# EAGLE design quadcopter (EAGLE 9.0.1)
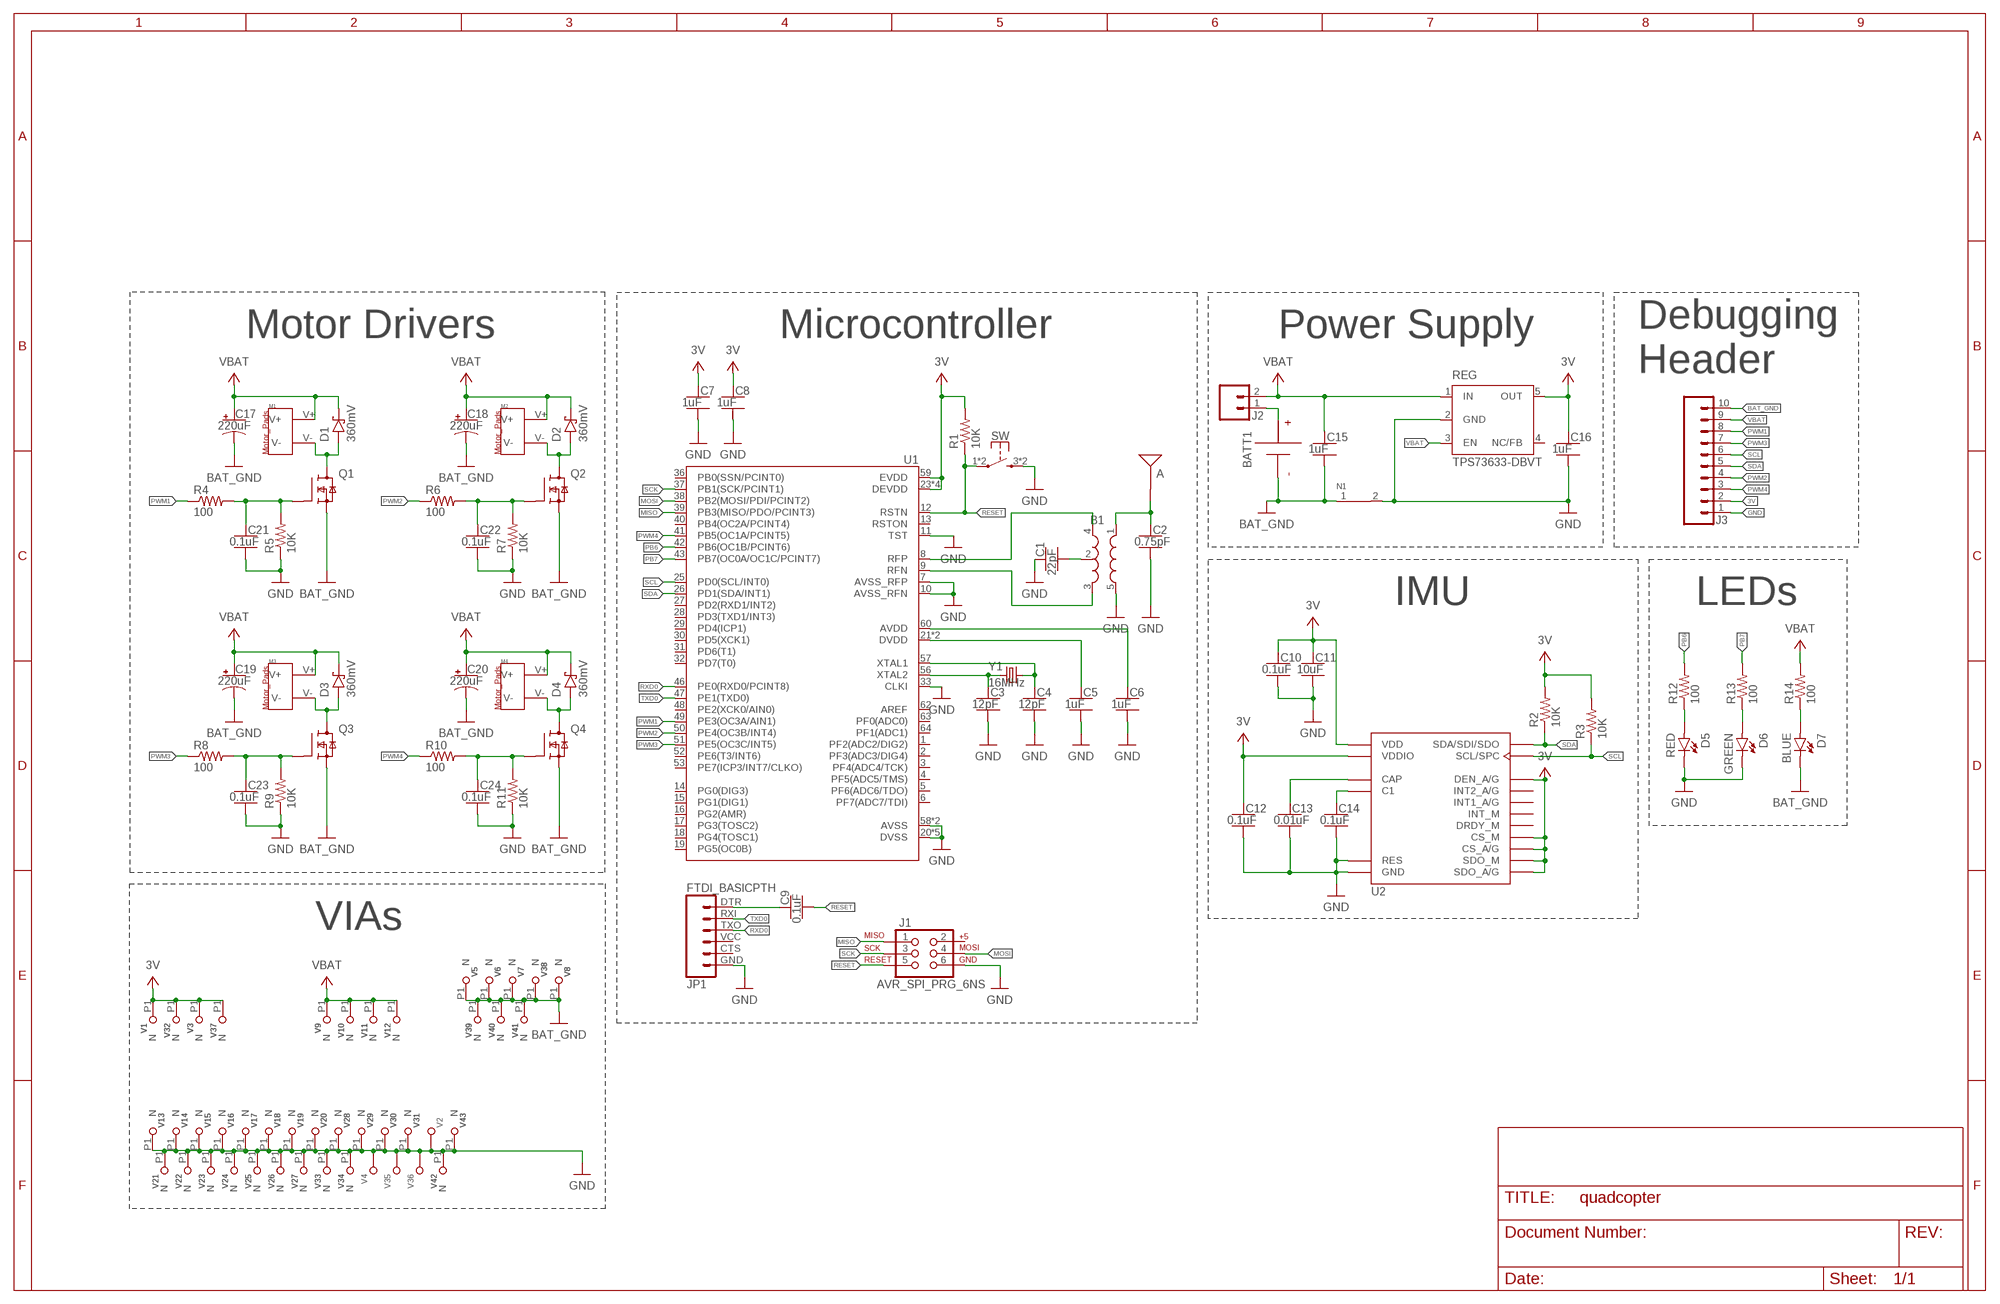
[diagram p0: schematic, sheet 1]
FRAME1 (FRAME_B_L): CREATOR: Unknown; DIST: Unknown; DISTPN: Unknown

## Parts
A  ANTENNA2SMD5  [ANTENNA-CHIP5]
B1  BALUN0805  [BALUN]
BATT1  BATTERY  [BATTERY-TERMINALS]
C1  22pF  CAPACITOR-NP_SMD-2012-0805_CERAMIC-22PF  [CAPC2012X140_HS]
C2  0.75pF  CAPACITOR-NP_SMD-2012-0805_CERAMIC-0.75PF  [CAPC2012X140_HS]
C3  12pF  CAPACITOR-NP_SMD-2012-0805_CERAMIC-12PF  [CAPC2012X140_HS]
C4  12pF  CAPACITOR-NP_SMD-2012-0805_CERAMIC-12PF  [CAPC2012X140_HS]
C5  1uF  CAPACITOR-NP_SMD-2012-0805_CERAMIC-1UF  [CAPC2012X140_HS]
C6  1uF  CAPACITOR-NP_SMD-2012-0805_CERAMIC-1UF  [CAPC2012X140_HS]
C7  1uF  CAPACITOR-NP_SMD-2012-0805_CERAMIC-1UF  [CAPC2012X140_HS]
C8  1uF  CAPACITOR-NP_SMD-2012-0805_CERAMIC-1UF  [CAPC2012X140_HS]
C9  0.1uF  CAPACITOR-NP_SMD-2012-0805_CERAMIC-0.1UF  [CAPC2012X140_HS]
C10  0.1uF  CAPACITOR-NP_SMD-2012-0805_CERAMIC-0.1UF  [CAPC2012X140_HS]
C11  10uF  CAPACITOR-NP_SMD-2012-0805_CERAMIC-10UF  [CAPC2012X140_HS]
C12  0.1uF  CAPACITOR-NP_SMD-2012-0805_CERAMIC-0.1UF  [CAPC2012X140_HS]
C13  0.01uF  CAPACITOR-NP_SMD-2012-0805_CERAMIC-0.01UF  [CAPC2012X140_HS]
C14  0.1uF  CAPACITOR-NP_SMD-2012-0805_CERAMIC-0.1UF  [CAPC2012X140_HS]
C15  1uF  CAPACITOR-NP_SMD-2012-0805_CERAMIC-1UF  [CAPC2012X140_HS]
C16  1uF  CAPACITOR-NP_SMD-2012-0805_CERAMIC-1UF  [CAPC2012X140_HS]
C17  220uF  CAPACITOR-POL_SMD-7043-D_TANTALUM-220UF  [CAPMP7343X310_HS]
C18  220uF  CAPACITOR-POL_SMD-7043-D_TANTALUM-220UF  [CAPMP7343X310_HS]
C19  220uF  CAPACITOR-POL_SMD-7043-D_TANTALUM-220UF  [CAPMP7343X310_HS]
C20  220uF  CAPACITOR-POL_SMD-7043-D_TANTALUM-220UF  [CAPMP7343X310_HS]
C21  0.1uF  CAPACITOR-NP_SMD-2012-0805_CERAMIC-0.1UF  [CAPC2012X140_HS]
C22  0.1uF  CAPACITOR-NP_SMD-2012-0805_CERAMIC-0.1UF  [CAPC2012X140_HS]
C23  0.1uF  CAPACITOR-NP_SMD-2012-0805_CERAMIC-0.1UF  [CAPC2012X140_HS]
C24  0.1uF  CAPACITOR-NP_SMD-2012-0805_CERAMIC-0.1UF  [CAPC2012X140_HS]
D1  360mV  DIODE-SCHOTTKY_SMD-SOD123-360MV  [SOD3716X135_HS]
D2  360mV  DIODE-SCHOTTKY_SMD-SOD123-360MV  [SOD3716X135_HS]
D3  360mV  DIODE-SCHOTTKY_SMD-SOD123-360MV  [SOD3716X135_HS]
D4  360mV  DIODE-SCHOTTKY_SMD-SOD123-360MV  [SOD3716X135_HS]
D5  RED  LED_RED  [LED_0805]
D6  GREEN  LED_GREEN  [LED_0805]
D7  BLUE  LED_BLUE  [LED_0805]
J1  AVR_SPI_PRG_6NS  [2X3-NS]
J2  MALE_HEADER_2POS-2X1-0.1IN  [MALE_HEADER_2X1_0.1IN]
J3  SIP-10_TH-254X10  [HDRV10W63P254_10X1_2540X254H838_HS]
JP1  FTDI_BASICPTH  [FTDI_BASIC]
M1  MOTOR_PADS  [MOTOR_PADS]
M2  MOTOR_PADS  [MOTOR_PADS]
M3  MOTOR_PADS  [MOTOR_PADS]
M4  MOTOR_PADS  [MOTOR_PADS]
N1  NET_BRIDGE  [NET_BRIDGE]
Q1  MOSFET_SOT-23  [SI2302CDS_T1_E3]
Q2  MOSFET_SOT-23  [SI2302CDS_T1_E3]
Q3  MOSFET_SOT-23  [SI2302CDS_T1_E3]
Q4  MOSFET_SOT-23  [SI2302CDS_T1_E3]
R1  10K  RESISTOR_SMD-2012-0805-10K  [RESC2012X60_HS]
R2  10K  RESISTOR_SMD-2012-0805-10K  [RESC2012X60_HS]
R3  10K  RESISTOR_SMD-2012-0805-10K  [RESC2012X60_HS]
R4  100  RESISTOR_SMD-2012-0805-100  [RESC2012X60_HS]
R5  10K  RESISTOR_SMD-2012-0805-10K  [RESC2012X60_HS]
R6  100  RESISTOR_SMD-2012-0805-100  [RESC2012X60_HS]
R7  10K  RESISTOR_SMD-2012-0805-10K  [RESC2012X60_HS]
R8  100  RESISTOR_SMD-2012-0805-100  [RESC2012X60_HS]
R9  10K  RESISTOR_SMD-2012-0805-10K  [RESC2012X60_HS]
R10  100  RESISTOR_SMD-2012-0805-100  [RESC2012X60_HS]
R11  10K  RESISTOR_SMD-2012-0805-10K  [RESC2012X60_HS]
R12  100  RESISTOR_SMD-2012-0805-100  [RESC2012X60_HS]
R13  100  RESISTOR_SMD-2012-0805-100  [RESC2012X60_HS]
R14  100  RESISTOR_SMD-2012-0805-100  [RESC2012X60_HS]
REG  TPS73633-DBVT  [SOT23-DBV]
SW  PUSHBUTTON_SMD-VERTICAL-1  [TE_FSM8JSMA_HS]
U1  ATMEGA128RFA1  [QFN-64]
U2  IMU_LSM9DS1TR  [LSM9DS1TR]
V1  LOCKED-VIA-0.254  [VIA-0.254MM]
V2  VIA_0.454  [VIA_0.454]
V3  LOCKED-VIA-0.254  [VIA-0.254MM]
V4  VIA_0.454  [VIA_0.454]
V5  LOCKED-VIA-0.254  [VIA-0.254MM]
V6  LOCKED-VIA-0.254  [VIA-0.254MM]
V7  LOCKED-VIA-0.254  [VIA-0.254MM]
V8  LOCKED-VIA-0.254  [VIA-0.254MM]
V9  LOCKED-VIA-0.254  [VIA-0.254MM]
V10  LOCKED-VIA-0.254  [VIA-0.254MM]
V11  LOCKED-VIA-0.254  [VIA-0.254MM]
V12  LOCKED-VIA-0.254  [VIA-0.254MM]
V13  LOCKED-VIA-0.254  [VIA-0.254MM]
V14  LOCKED-VIA-0.254  [VIA-0.254MM]
V15  LOCKED-VIA-0.254  [VIA-0.254MM]
V16  LOCKED-VIA-0.254  [VIA-0.254MM]
V17  LOCKED-VIA-0.254  [VIA-0.254MM]
V18  LOCKED-VIA-0.254  [VIA-0.254MM]
V19  LOCKED-VIA-0.254  [VIA-0.254MM]
V20  LOCKED-VIA-0.254  [VIA-0.254MM]
V21  LOCKED-VIA-0.254  [VIA-0.254MM]
V22  LOCKED-VIA-0.254  [VIA-0.254MM]
V23  LOCKED-VIA-0.254  [VIA-0.254MM]
V24  LOCKED-VIA-0.254  [VIA-0.254MM]
V25  LOCKED-VIA-0.254  [VIA-0.254MM]
V26  LOCKED-VIA-0.254  [VIA-0.254MM]
V27  LOCKED-VIA-0.254  [VIA-0.254MM]
V28  LOCKED-VIA-0.254  [VIA-0.254MM]
V29  LOCKED-VIA-0.254  [VIA-0.254MM]
V30  LOCKED-VIA-0.254  [VIA-0.254MM]
V31  LOCKED-VIA-0.254  [VIA-0.254MM]
V32  LOCKED-VIA-0.254  [VIA-0.254MM]
V33  LOCKED-VIA-0.254  [VIA-0.254MM]
V34  LOCKED-VIA-0.254  [VIA-0.254MM]
V35  VIA_0.454  [VIA_0.454]
V36  VIA_0.454  [VIA_0.454]
V37  LOCKED-VIA-0.254  [VIA-0.254MM]
V38  LOCKED-VIA-0.254  [VIA-0.254MM]
V39  LOCKED-VIA-0.254  [VIA-0.254MM]
V40  LOCKED-VIA-0.254  [VIA-0.254MM]
V41  LOCKED-VIA-0.254  [VIA-0.254MM]
V42  LOCKED-VIA-0.254  [VIA-0.254MM]
V43  LOCKED-VIA-0.254  [VIA-0.254MM]
Y1  16MHz  CRYSTAL5X3  [CRYSTAL-SMD-5X3]

## Nets
3V: C7.1 C8.1 C10.1 C11.1 C12.1 C16.1 J3.2 R1.2 R2.2 R3.2 REG.5(OUT) U1.23(DEVDD) U1.34(DEVDD) U1.44(DEVDD) U1.54(DEVDD) U1.59(EVDD) U2.CS_A/G U2.CS_M U2.DEN_A/G U2.SDO_A/G U2.SDO_M U2.VDD U2.VDD_23(VDD) U2.VDDIO U2.VDDIO_3(VDDIO) V1.P1(N) V3.P1(N) V32.P1(N) V37.P1(N)
BAT_GND [HIGHCURRENT]: BATT1.-(N) C15.2 C17.2(-) C18.2(-) C19.2(-) C20.2(-) D7.C J3.10 N1.1 Q1.S Q2.S Q3.S Q4.S V5.P1(N) V6.P1(N) V7.P1(N) V8.P1(N) V38.P1(N) V39.P1(N) V40.P1(N) V41.P1(N)
BATT1: BATT1.+(P) J2.1
C1: B1.2(GND) C1.2
C2 [RFSIG]: A.FEED(SIGNAL) B1.1(IN) C2.1
C3: C3.1 U1.56(XTAL2) Y1.1
C4: C4.1 U1.57(XTAL1) Y1.3
C5: C5.1 U1.21(DVDD) U1.22(DVDD)
C6: C6.1 U1.60(AVDD)
C9: C9.1 JP1.DTR
C13: C13.1 U2.CAP
C14: C14.1 U2.C1
C21: C21.1 Q1.G R4.2 R5.2
C22: C22.1 Q2.G R6.2 R7.2
C23: C23.1 Q3.G R8.2 R9.2
C24: C24.1 Q4.G R10.2 R11.2
D5: D5.A R12.1
D6: D6.A R13.1
D7: D7.A R14.1
GND: B1.5(GND) C1.1 C2.2 C3.2 C4.2 C5.2 C6.2 C7.2 C8.2 C10.2 C11.2 C12.2 C13.2 C14.2 C16.2 C21.2 C22.2 C23.2 C24.2 D5.C D6.C J1.6 J3.1 JP1.GND N1.2 R5.1 R7.1 R9.1 R11.1 REG.2(GND) SW.3 SW.4 U1.7(AVSS_RFP) U1.10(AVSS_RFN) U1.11(TST) U1.20(DVSS) U1.24(DVSS) U1.33(CLKI) U1.35(DVSS) U1.45(DVSS) U1.55(DVSS) U1.58(AVSS) U1.61(AVSS) U2.GND U2.GND_20(GND) U2.RES U2.RES_15(RES) U2.RES_16(RES) U2.RES_17(RES) U2.RES_18(RES) V2.VIA V4.VIA V13.P1(N) V14.P1(N) V15.P1(N) V16.P1(N) V17.P1(N) V18.P1(N) V19.P1(N) V20.P1(N) V21.P1(N) V22.P1(N) V23.P1(N) V24.P1(N) V25.P1(N) V26.P1(N) V27.P1(N) V28.P1(N) V29.P1(N) V30.P1(N) V31.P1(N) V33.P1(N) V34.P1(N) V35.VIA V36.VIA V42.P1(N) V43.P1(N)
M1 [HIGHCURRENT]: D1.A M1.V- Q1.D
M2 [HIGHCURRENT]: D2.A M2.V- Q2.D
M3 [HIGHCURRENT]: D3.A M3.V- Q3.D
M4 [HIGHCURRENT]: D4.A M4.V- Q4.D
MISO: J1.1 U1.39(PB3(MISO/PDO/PCINT3))
MOSI: J1.4 U1.38(PB2(MOSI/PDI/PCINT2))
PB6: R12.2 U1.42(PB6(OC1B/PCINT6))
PB7: R13.2 U1.43(PB7(OC0A/OC1C/PCINT7))
PWM1: J3.8 R4.1 U1.49(PE3(OC3A/AIN1))
PWM2: J3.4 R6.1 U1.50(PE4(OC3B/INT4))
PWM3: J3.7 R8.1 U1.51(PE5(OC3C/INT5))
PWM4: J3.3 R10.1 U1.41(PB5(OC1A/PCINT5))
RESET: C9.2 J1.5 R1.1 SW.1 SW.2 U1.12(RSTN)
RFN: B1.3(OUT2) U1.9(RFN)
RFP: B1.4(OUT1) U1.8(RFP)
RXD0: JP1.TXO U1.46(PE0(RXD0/PCINT8))
SCK: J1.3 U1.37(PB1(SCK/PCINT1))
SCL: J3.6 R3.1 U1.25(PD0(SCL/INT0)) U2.SCL/SPC
SDA: J3.5 R2.1 U1.26(PD1(SDA/INT1)) U2.SDA/SDI/SDO
TXD0: JP1.RXI U1.47(PE1(TXD0))
VBAT [HIGHCURRENT]: C15.1 C17.1(+) C18.1(+) C19.1(+) C20.1(+) D1.C D2.C D3.C D4.C J2.2 J3.9 M1.V+ M2.V+ M3.V+ M4.V+ R14.2 REG.1(IN) REG.3(EN) V9.P1(N) V10.P1(N) V11.P1(N) V12.P1(N)
Unconnected: J1.2 JP1.CTS JP1.VCC REG.4(NC/FB) U1.1(PF2(ADC2/DIG2)) U1.2(PF3(ADC3/DIG4)) U1.3(PF4(ADC4/TCK)) U1.4(PF5(ADC5/TMS)) U1.5(PF6(ADC6/TDO)) U1.6(PF7(ADC7/TDI)) U1.13(RSTON) U1.14(PG0(DIG3)) U1.15(PG1(DIG1)) U1.16(PG2(AMR)) U1.17(PG3(TOSC2)) U1.18(PG4(TOSC1)) U1.19(PG5(OC0B)) U1.27(PD2(RXD1/INT2)) U1.28(PD3(TXD1/INT3)) U1.29(PD4(ICP1)) U1.30(PD5(XCK1)) U1.31(PD6(T1)) U1.32(PD7(T0)) U1.36(PB0(SSN/PCINT0)) U1.40(PB4(OC2A/PCINT4)) U1.48(PE2(XCK0/AIN0)) U1.52(PE6(T3/INT6)) U1.53(PE7(ICP3/INT7/CLKO)) U1.62(AREF) U1.63(PF0(ADC0)) U1.64(PF1(ADC1)) U2.DRDY_M U2.INT1_A/G U2.INT2_A/G U2.INT_M

## Notes on the sheet
- Motor Drivers | Microcontroller | Power Supply
- Debugging
  Header
- IMU | LEDs
- VIAs

## Library data of the parts
A = quadparts_prebuilt:ANTENNA2: Chip antenna Single endded antenna. Common with smaller chip antennas. CHIP4 package is the GPS Chip Antenna SKU: GPS-08418. CHIP5 package is 2.4GHz chip antenna SKU: WRL-00144.; CREATOR: Swanson; DATASHEET: http://www.linxtechnologies.com/resources/data-guides/ant-xxx-chp-x.pdf; DIST: Digikey; DISTPN: ANT-2.45-CHPCT-ND; MFR: Linx Technologies Inc.; MPN: ANT-2.45-CHP-T; PRICE: 3.16; REVIEWER: Swanson
B1 = quadparts_prebuilt:BALUN: 0805 footprint balun- Ember 351/357; CREATOR: Swanson; DATASHEET: http://katalog.we-online.de/pbs/datasheet/748421245.pdf; DIST: Digikey; DISTPN: 732-2230-6-ND; MFR: Wurth Electronics Inc; MPN: 748421245; PRICE: 2.63; REVIEWER: Swanson
BATT1 = quadparts_prebuilt:BATTERY; CREATOR: Swanson; DIST: NA; DISTPN: NA
C1 = quadparts_prebuilt:CAPACITOR-NP_: Nonpolarized capacitor; CREATOR: Swanson; DIST: Digikey; DISTPN: 490-5534-1-ND; MFR: Murata Electronics North America; MPN: GRM21A5C2E220JW01D; REVIEWER: Swanson
C2 = quadparts_prebuilt:CAPACITOR-NP_: Nonpolarized capacitor; CREATOR: Swanson; DIST: Digikey; DISTPN: 490-3585-1-ND; MFR: Murata Electronics North America; MPN: GQM2195C2AR75CB01D; REVIEWER: Swanson
C3 C4 = quadparts_prebuilt:CAPACITOR-NP_: Nonpolarized capacitor; CREATOR: Swanson; DIST: Digikey; DISTPN: 490-5531-1-ND; MFR: Murata Electronics North America; MPN: GRM21A5C2E120JW01D; REVIEWER: Swanson
C5-C8 C15 C16 = quadparts_prebuilt:CAPACITOR-NP_: Nonpolarized capacitor; CREATOR: Swanson; DIST: Digikey; DISTPN: 587-1281-1-ND; MFR: Taiyo Yuden; MPN: TMK212B7105KG-T; REVIEWER: Swanson
C9 C10 C12 C14 C21-C24 = quadparts_prebuilt:CAPACITOR-NP_: Nonpolarized capacitor; CREATOR: Swanson; DIST: Digikey; DISTPN: 445-1418-1-ND; MFR: TDK; MPN: C2012X7R2A104K125AA; REVIEWER: Swanson
C11 = quadparts_prebuilt:CAPACITOR-NP_: Nonpolarized capacitor; CREATOR: Swanson; DIST: Digikey; DISTPN: 445-14388-1-ND; MFR: TDK Corporation; MPN: C2012X5R1E106M085AC; REVIEWER: Swanson
C13 = quadparts_prebuilt:CAPACITOR-NP_: Nonpolarized capacitor; CREATOR: Swanson; DIST: Digikey; DISTPN: 1608-1458-1-ND; MFR: Knowles Syfer; MPN: 0805J0500104KJT; REVIEWER: Swanson
C17-C20 = quadparts_prebuilt:CAPACITOR-POL_: Polarized capacitor; CREATOR: Swanson; DIST: Digikey; DISTPN: 478-8912-1-ND; MFR: AVX Corporation; MPN: TAJD227K006RNJ; REVIEWER: Swanson
D1-D4 = quadparts_prebuilt:DIODE-SCHOTTKY_: Schottky diode; CREATOR: Swanson; DIST: Digikey; DISTPN: CRS08QMCT-ND; MFR: Toshiba Semiconductor and Storage; MPN: CRS08(TE85L,Q,M); REVIEWER: Swanson
D5 = custom:LED_: Light emitting diode; CREATOR: Jeongjoon; DIST: Digikey; DISTPN: 160-1415-1-ND; MFR: Lite-On Inc; MPN: LTST-C170KRKT
D6 = custom:LED_: Light emitting diode; CREATOR: Jeongjoon; DIST: Digikey; DISTPN: 160-1887-1-ND; MFR: Lite-On Inc; MPN: LTST-C170TGKT
D7 = custom:LED_: Light emitting diode; CREATOR: Jeongjoon; DIST: Digikey; DISTPN: 160-1579-1-ND; MFR: Lite-On Inc; MPN: LTST-C170TBKT
J1 = quadparts_prebuilt:AVR_SPI_PRG_6: AVR ISP 6 Pin This is the reduced ISP connector for AVR programming. Common on Arduino. This footprint will take up less PCB space and can be used with a 10-pin to 6-pin adapter such as SKU: BOB-08508; CREATOR: Swanson; DATASHEET: http://portal.fciconnect.com/Comergent//fci/drawing/67996.pdf; DIST: Digikey; DISTPN: 609-3234-ND; MFR: Amphenol FCI; MPN: 67997-206HLF; PRICE: 0.31; REVIEWER: Swanson
J2 = custom:MALE_HEADER_2POS: 2 pin single inline pin header, socket, or connector; CREATOR: SWANSON; DIST: Digikey; DISTPN: 3M9447-ND; MFR: 3M; MPN: 961102-6404-AR; REVIEWER: Swanson
J3 = quadparts_prebuilt:SIP-10_: 10 pin single inline pin header, socket, or connector; CREATOR: Swanson; DATASHEET: http://portal.fciconnect.com/Comergent//fci/drawing/68000.pdf; DIST: Digikey; DISTPN: 609-3250-ND; MFR: Amphenol FCI; MPN: 68000-110HLF; PRICE: 0.55; REVIEWER: Swanson
JP1 = quadparts_prebuilt:FTDI_BASIC: FTDI Basic header with labels; CREATOR: Swanson; DATASHEET: http://portal.fciconnect.com/Comergent//fci/drawing/68015.pdf; DIST: Digikey; DISTPN: 609-3327-ND; MFR: Amphenol FCI; MPN: 68016-406HLF; PRICE: 0.33; REVIEWER: Swanson
M1-M4 = quadparts_prebuilt:MOTOR_PADS; CREATOR: Swanson; DIST: NA; DISTPN: NA; MFR: NA; MPN: NA; REVIEWER: Swanson
N1 = custom:NET_: Net Bridge; CREATOR: Jeongjoon; DIST: NA; DISTPN: NA
Q1-Q4 = custom:MOSFET_: N-Channel MOSFET; CREATOR: Jeongjoon; DIST: Digikey; DISTPN: SI2302CDS-T1-E3CT-ND; MFR: Vishay Siliconix; MPN: SI2302CDS-T1-E3
R1-R3 R5 R7 R9 R11 = quadparts_prebuilt:RESISTOR_: Resistor; CREATOR: Swanson; DIST: Digikey; DISTPN: 311-10KARCT-ND; MFR: Yageo; MPN: RC0805JR-0710KL; REVIEWER: Swanson
R4 R6 R8 R10 R12-R14 = quadparts_prebuilt:RESISTOR_: Resistor; CREATOR: Swanson; DIST: Digikey; DISTPN: 311-100ARCT-ND; MFR: Yageo; MPN: RC0805JR-07100RL; REVIEWER: Swanson
REG = quadparts_prebuilt:TPS73633-DBVT; CREATOR: Swanson; DATASHEET: http://www.ti.com/lit/ds/symlink/lp3985.pdf; DIST: Digikey; DISTPN: LP3985IM5X-3.0/NOPBCT-ND; MFR: Texas Instruments; MPN: LP3985IM5X-3.0/NOPB; PRICE: 0.59; REVIEWER: Swanson
SW = quadparts_prebuilt:PUSHBUTTON_: Pushbutton with 2 pins shorting 1 to 2 and two extra mounting pins 3 & 4; CREATOR: Swanson; DIST: Digikey; DISTPN: 450-1129-ND; MFR: TE Connectivity Alcoswitch Switches; MPN: FSM4JSMA; REVIEWER: Swanson
U1 = quadparts_prebuilt:ATMEGA128RFA1: ATmega128RFA1 8-bit AVR Microcontroller with Low Power 2.4GHz Transceiver for ZigBee and IEEE 802.15.4; CREATOR: Swanson; DATASHEET: http://www.atmel.com/Images/Atmel-8266-MCU_Wireless-ATmega128RFA1_Datasheet.pdf; DIST: Digikey; DISTPN: ATMEGA128RFA1-ZU-ND; MFR: Atmel; MPN: ATMEGA128RFA1-ZUR00; PRICE: 10.21; REVIEWER: Swanson
U2 = custom:IMU_: LSM9DS1TR 9-Axis IMU; CREATOR: Jeongjoon; DIST: Digikey; DISTPN: 497-14946-1-ND; MFR: STMicroelectronics; MPN: LSM9DS1TR
V1 V3 V5-V34 V37-V43 = quadparts_prebuilt:LOCKED-VIA; CREATOR: Swanson; DIST: NA; DISTPN: NA
V2 V4 V35 V36 = custom:VIA_: Via; CREATOR: Jeongjoon; DIST: N/A; DISTPN: N/A; MFR: N/A; MPN: N/A
Y1 = quadparts_prebuilt:CRYSTAL: Various standard crystals. Proven footprints.; CREATOR: Swanson; DATASHEET: http://www.abracon.com/Resonators/abm3b.pdf; DIST: Digikey; DISTPN: 535-9122-1-ND; MFR: Abracon LLC; MPN: ABM3B-16.000MHZ-B2-T; PRICE: 0.68; PROD_ID: XTAL-08218; REVIEWER: Swanson

## Net classes
1 RFSIG: width 0.762 mm
2 HIGHCURRENT: width 0.762 mm

## Board
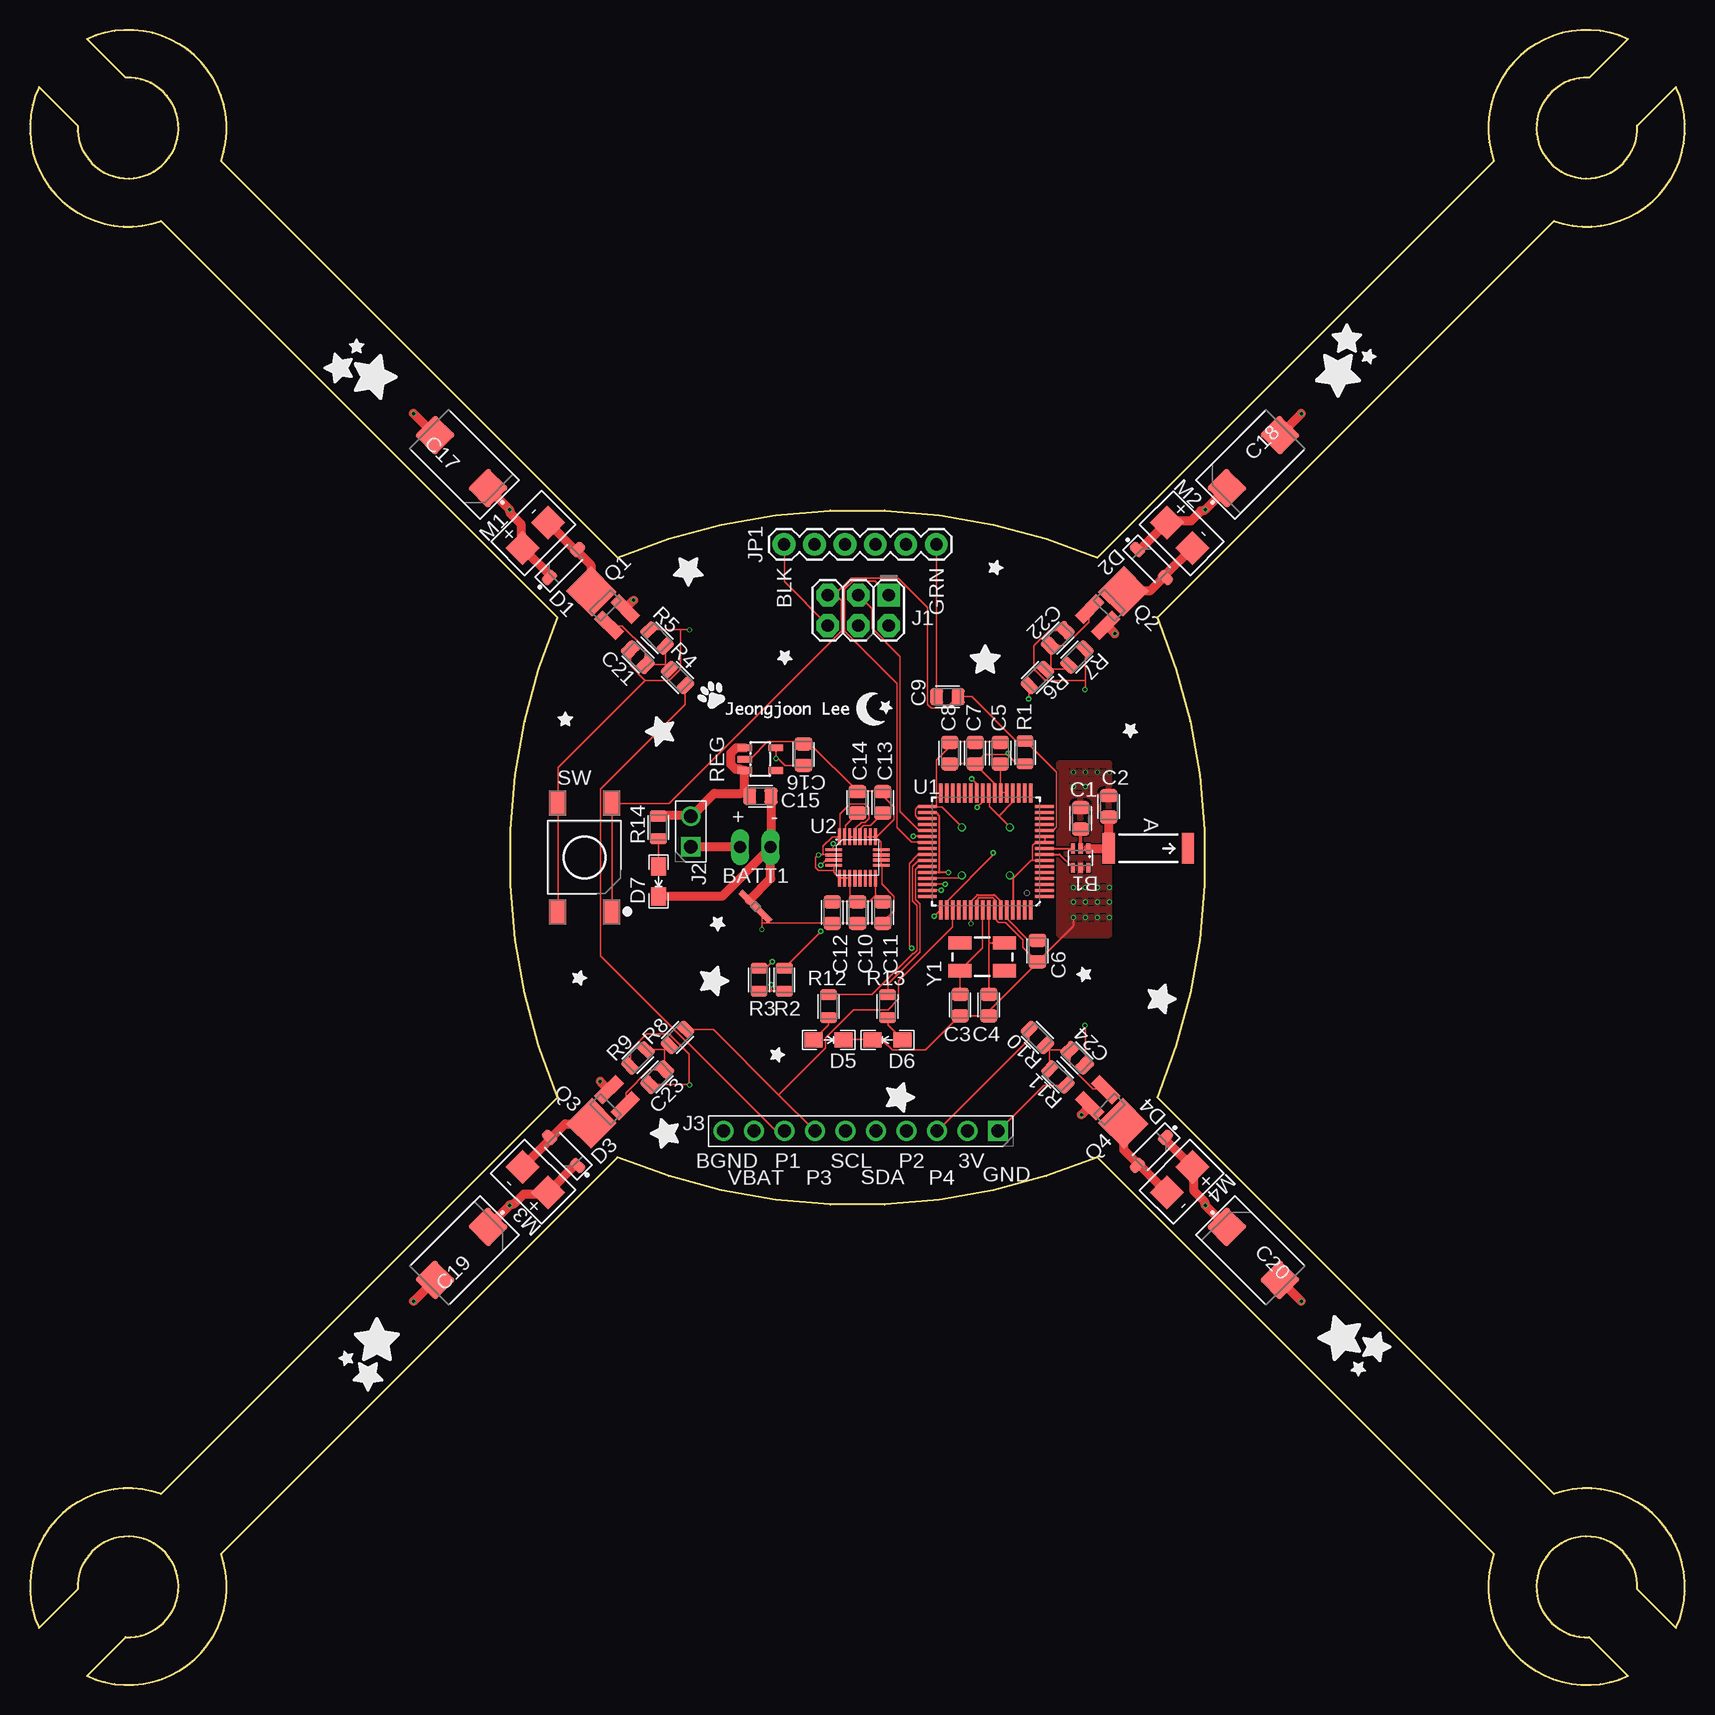
[diagram p1: board, top side]
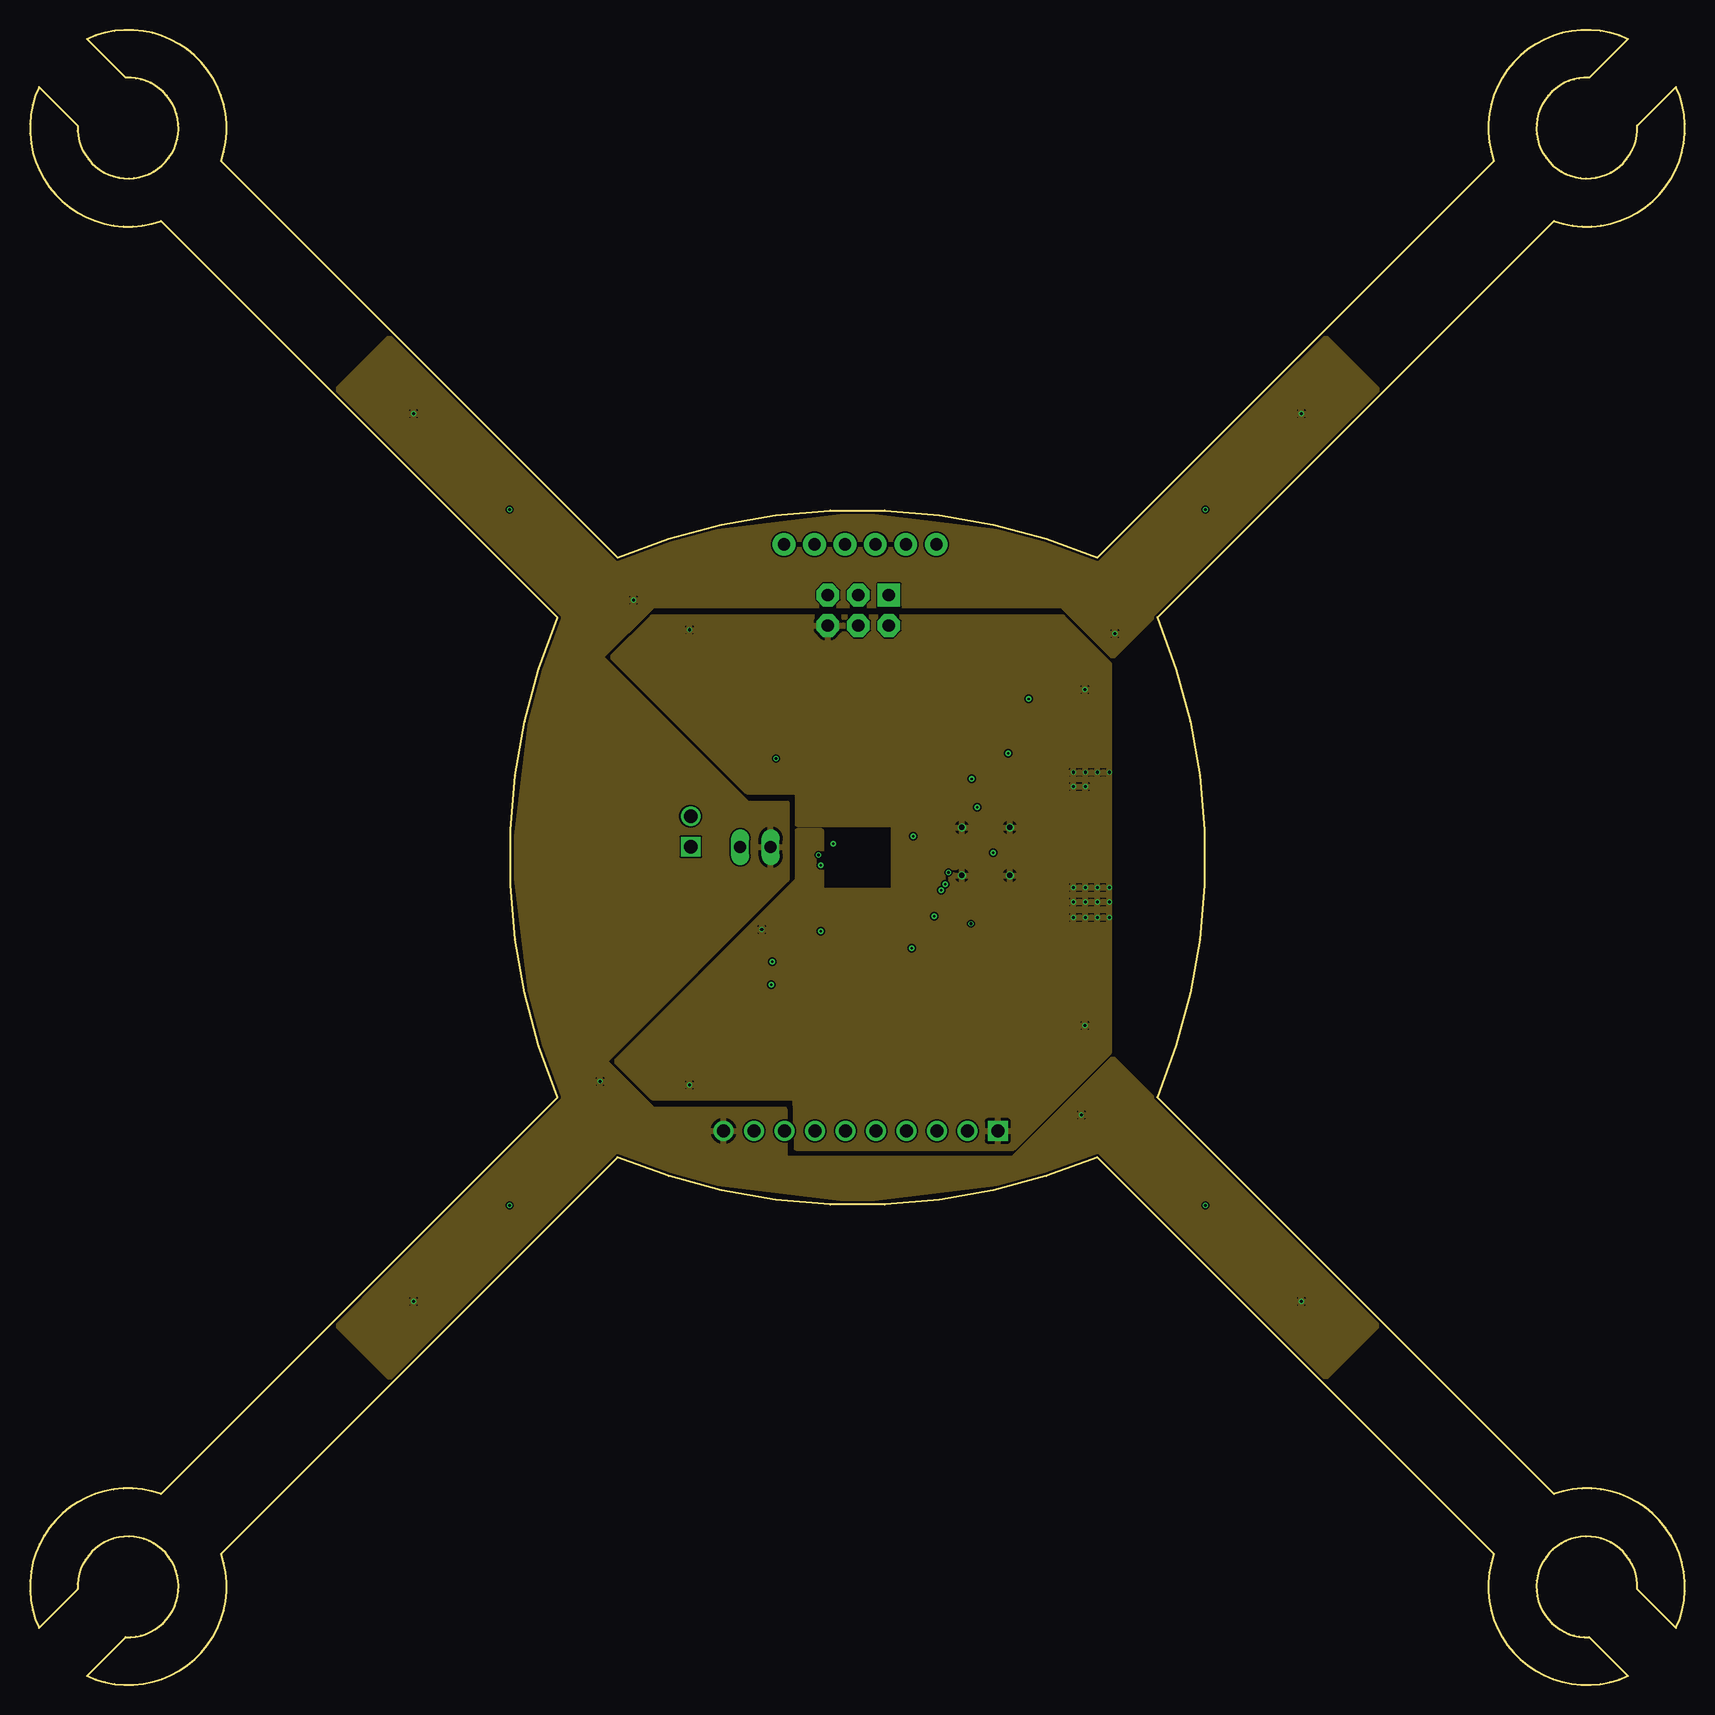
[diagram p2: board, inner layer Route2]
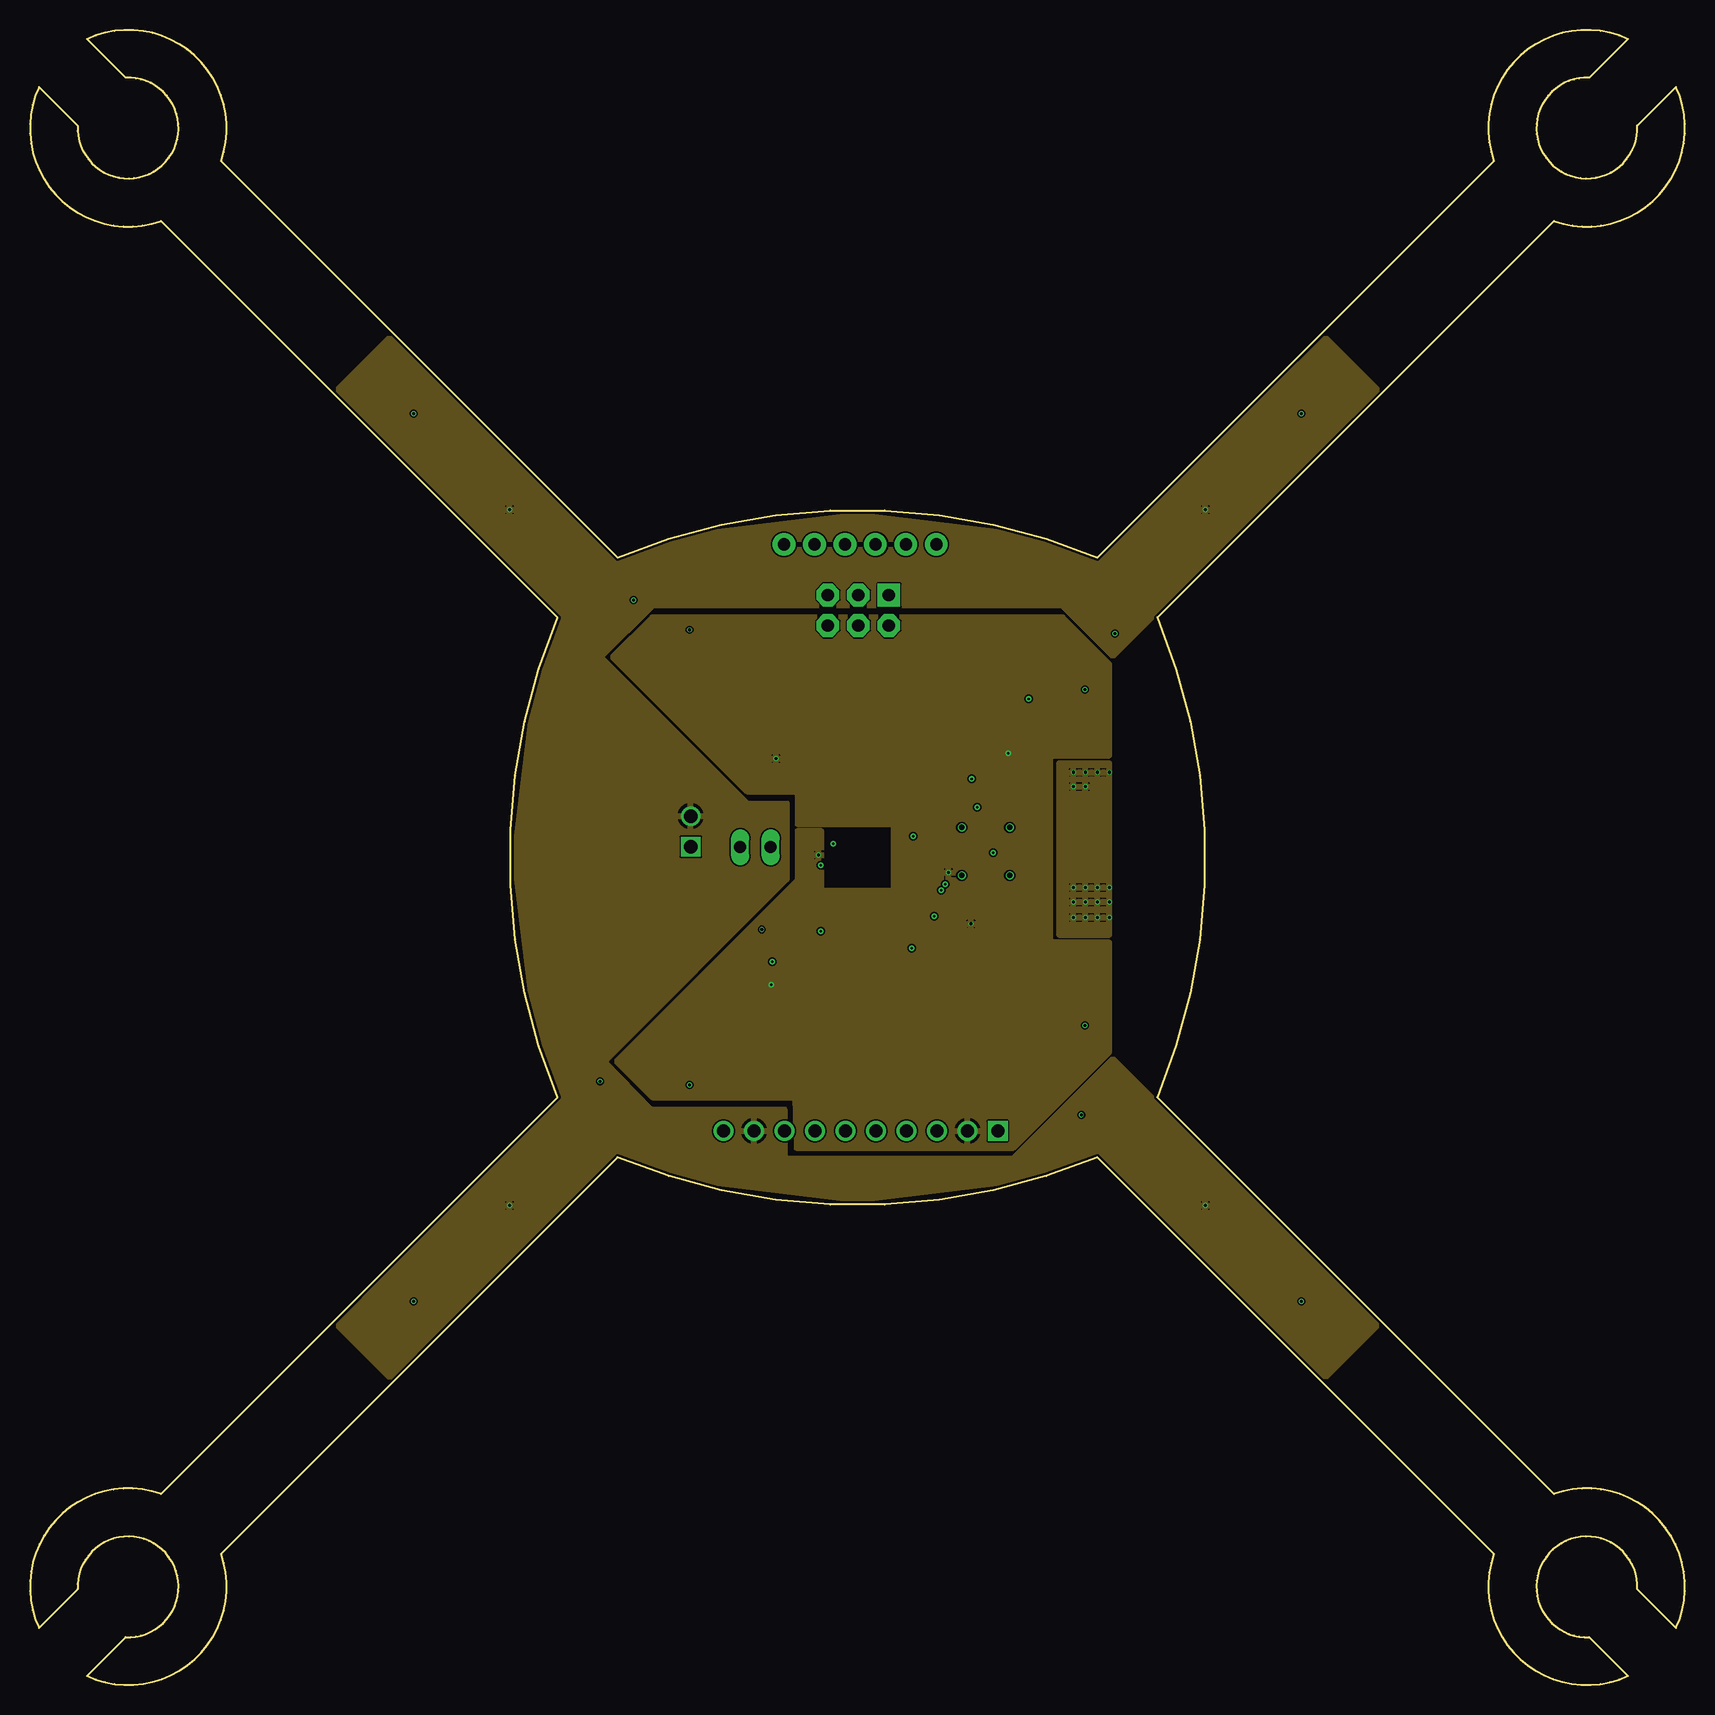
[diagram p3: board, inner layer Route15]
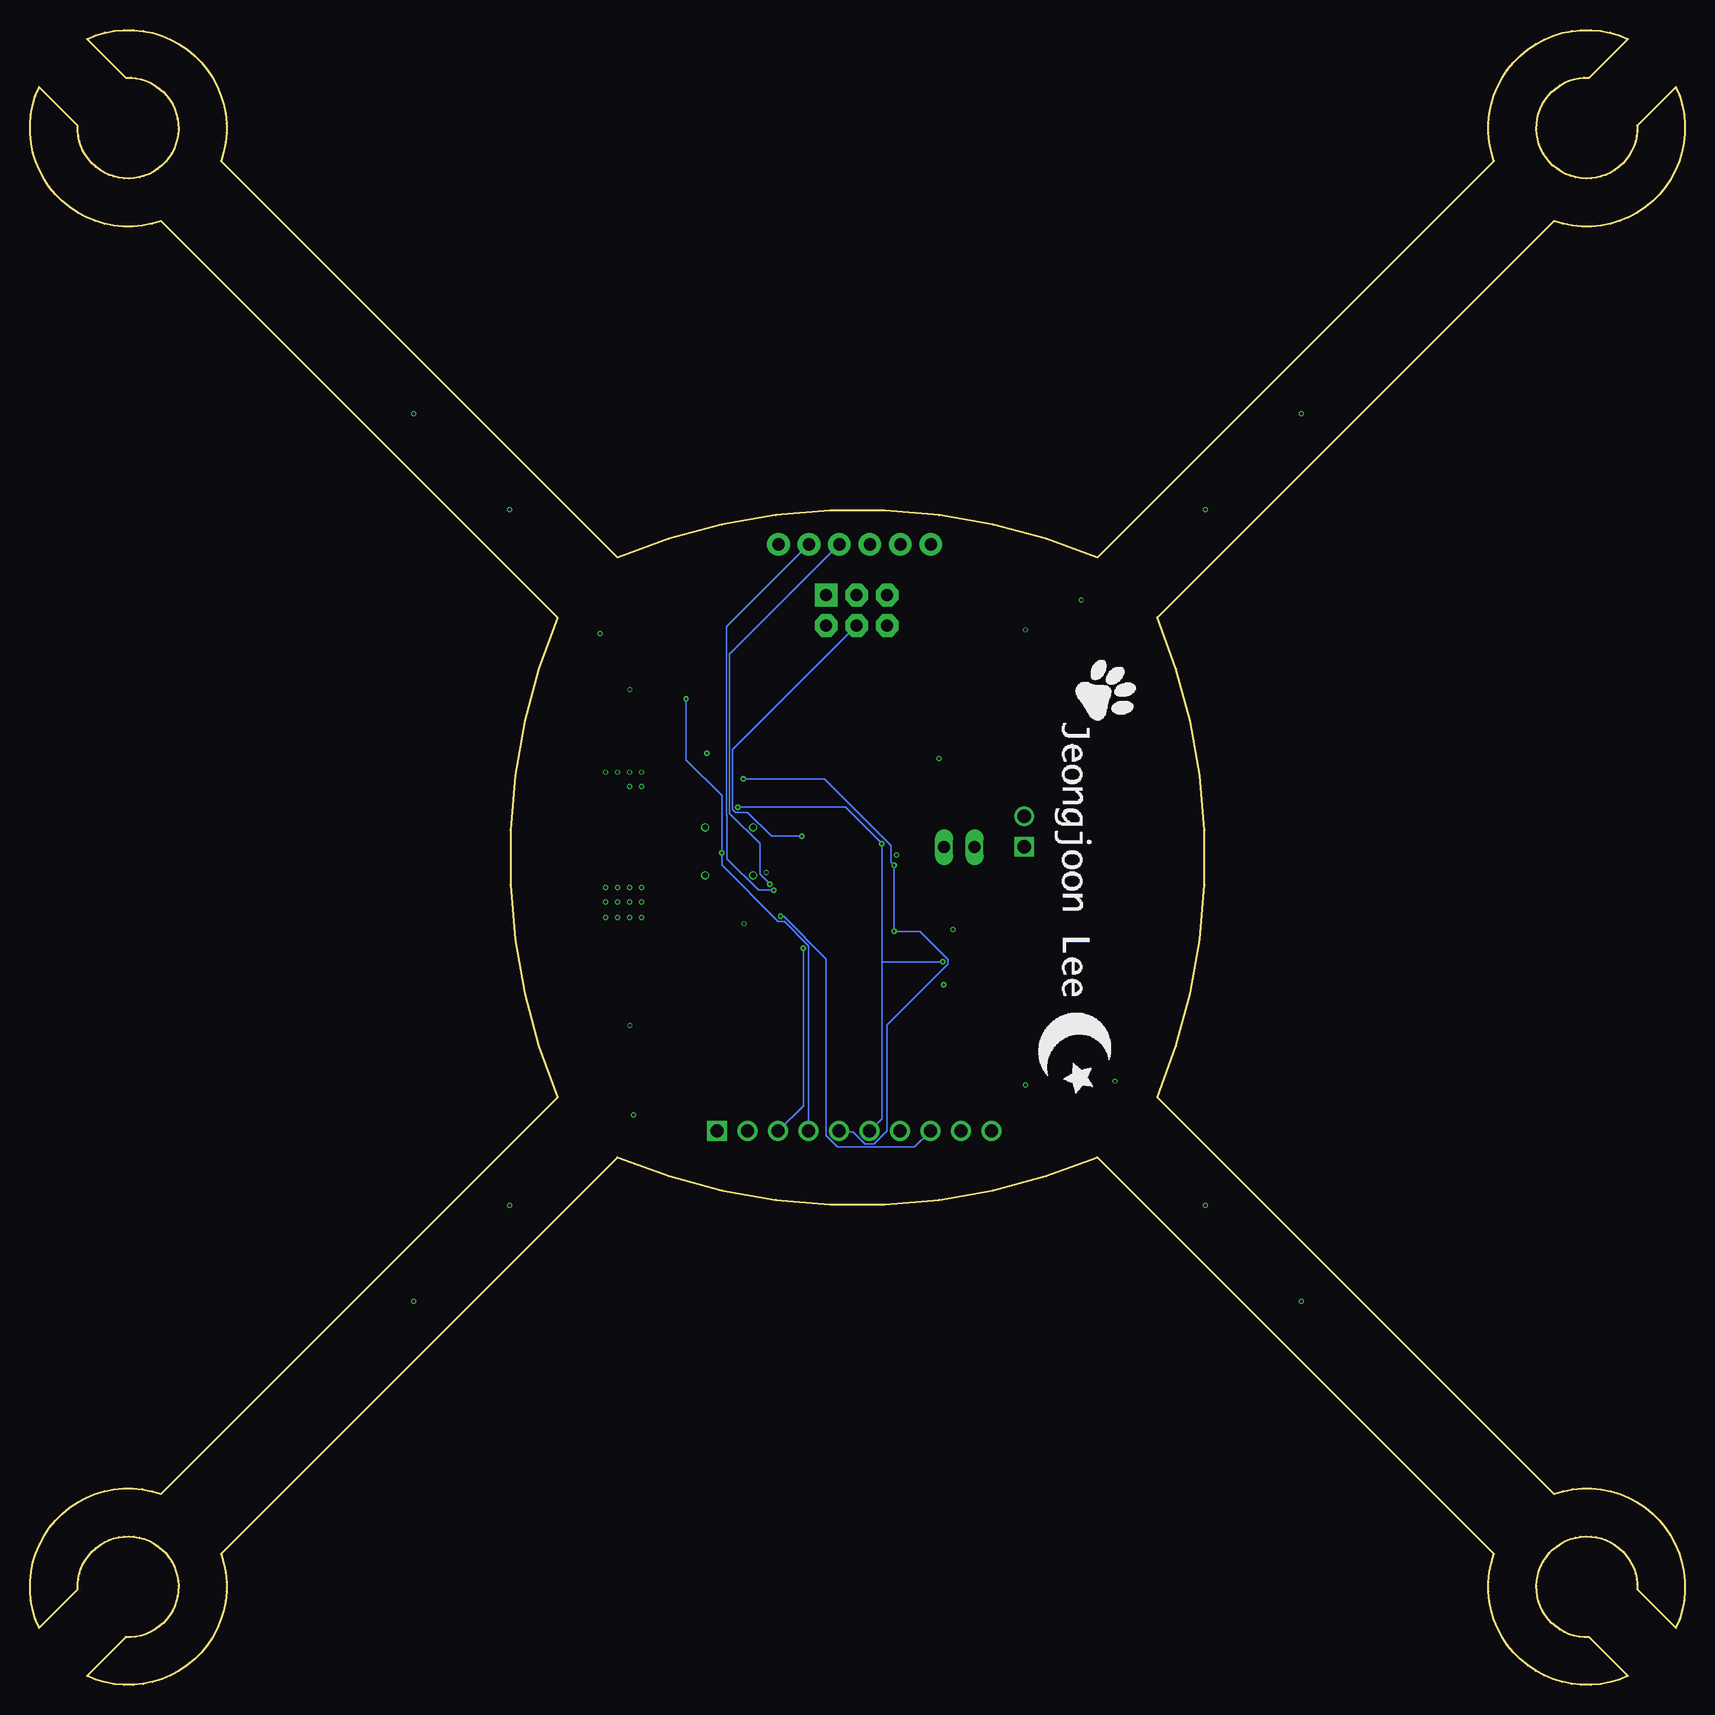
[diagram p4: board, bottom side, seen from below]

Size 137.95 x 137.95 mm. Coordinates in mm from the lower left corner, seen from the top.
Outline: 48.98,93.98 arc-45 88.98,93.98 122.03,127.03 arc-134 133.2,137.2 129.98,133.98 arc275 133.98,129.98 137.2,133.2 arc-134 127.03,122.03 93.98,88.98 arc-45 93.98,48.98 127.03,15.93 arc-134 137.2,4.75 133.98,7.98 arc275 129.98,3.98 133.2,0.75 arc-134 122.03,10.93 88.98,43.98 arc-45 48.98,43.98 15.93,10.93 arc-134 4.75,0.75 7.98,3.98 arc275 3.98,7.98 0.75,4.75 arc-134 10.93,15.93 43.98,48.98 arc-45 43.98,88.98 10.93,122.03 arc-134 0.75,133.2 3.98,129.98 arc275 7.98,133.98 4.75,137.2 arc-134 15.93,127.03 48.98,93.98
Copper layers (1*2*15*16): Top 0.035559375mm / dielectric 1.501140625mm / Route2 0.035559375mm / dielectric 0.149859375mm / Route15 0.035559375mm / dielectric 0.200659375mm / Bottom 0.035559375mm
Design rules "jlcpcb-4layer-5mil": minimum track width 5mil, minimum drill 0.2mm, track to track 5mil, track to pad 5mil, pad to pad 5mil, via to via 5mil, smd to smd 5mil, copper to edge 0.2mm, drill to drill 10mil, minimum pad ring 3mil, minimum via ring 5mil, stop-mask expansion 3mil, vias tented up to drill 0.45mm, thermal gap 10mil
bKeepout: area 67.5,67.8 to 70.5,70.2
tRestrict: area 67.5,67.8 to 70.5,70.2; area 90.6,62.5 to 97.3,76.8
bRestrict: area 90.6,62.5 to 97.3,76.8

### Footprints (pad centres in the part's own frame; a part is rotated, then mirrored left to right if it is on the bottom)
ANTENNA-CHIP5 = smd 1.016 x 2.54: FEED -3.302,0; NC 3.302,0
BALUN = smd 0.35 x 0.8: 1 -0.65,-0.8; 2 0,-0.8; 3 0.65,-0.8; 4 0.65,0.8; 5 0,0.8; 6 -0.65,0.8
BATTERY-TERMINALS = drill 1 long: + -1.27,-0.635; - 1.27,-0.635
CAPC2012X140_HS = smd 1.08 x 1.42: 1 -0.895,0; 2 0.895,0
CAPMP7343X310_HS = smd 2.37 x 2.43: 1 -3.12,0; 2 3.12,0
SOD3716X135_HS = smd 1.25 x 0.8: A 1.665,0; C -1.665,0
LED_0805 = smd 1.5 x 1.25: A -1.25,0; C 1.25,0
2X3-NS = drill 1.016 pad 1.88 square: 1 -2.54,-1.27 | drill 1.016 pad 1.88 octagon: 2 -2.54,1.27; 3 0,-1.27; 4 0,1.27; 5 2.54,-1.27; 6 2.54,1.27
MALE_HEADER_2X1_0.1IN = drill 1.1 pad 1.65 square: 1 0,0 | drill 1.1 pad 1.65: 2 2.54,0
HDRV10W63P254_10X1_2540X254H838_HS = drill 1.1 pad 1.65 square: 1 0,0 | drill 1.1 pad 1.65: 2 2.54,0; 3 5.08,0; 4 7.62,0; 5 10.16,0; 6 12.7,0; 7 15.24,0; 8 17.78,0; 9 20.32,0; 10 22.86,0
FTDI_BASIC = drill 1.016 pad 1.88: CTS 10.16,0; DTR 0,0; GND 12.7,0; RXI 2.54,0; TXO 5.08,0; VCC 7.62,0
MOTOR_PADS = smd 2 x 2: V+ -1,0; V- 2,0
NET_BRIDGE = smd 2 x 0.5: 1 -0.75,0; 2 0.75,0
SI2302CDS_T1_E3 = smd 2.9 x 3.05: D 0,1.65 | smd 1 x 2.5: G -0.95,-1.375; S 0.95,-1.375
RESC2012X60_HS = smd 0.92 x 1.38: 1 -0.955,0; 2 0.955,0
SOT23-DBV = smd 0.55 x 1.2: 1 -0.95,-1.3; 2 0,-1.3; 3 0.95,-1.3; 4 0.95,1.3; 5 -0.95,1.3
TE_FSM8JSMA_HS = smd 1.4 x 2.1: 1 -2.25,4.55; 2 -2.25,-4.55; 3 2.25,4.55; 4 2.25,-4.55
QFN-64 = smd 1.562 x 0.28: 1 -4.881,3.75; 2 -4.881,3.25; 3 -4.881,2.75; 4 -4.881,2.25; 5 -4.881,1.75; 6 -4.881,1.25; 7 -4.881,0.75; 8 -4.881,0.25; 9 -4.881,-0.25; 10 -4.881,-0.75; 11 -4.881,-1.25; 12 -4.881,-1.75; 13 -4.881,-2.25; 14 -4.881,-2.75; 15 -4.881,-3.25; 16 -4.881,-3.75; 33 4.881,-3.75; 34 4.881,-3.25; 35 4.881,-2.75; 36 4.881,-2.25; 37 4.881,-1.75; 38 4.881,-1.25; 39 4.881,-0.75; 40 4.881,-0.25; 41 4.881,0.25; 42 4.881,0.75; 43 4.881,1.25; 44 4.881,1.75; 45 4.881,2.25; 46 4.881,2.75; 47 4.881,3.25; 48 4.881,3.75 | smd 0.28 x 1.562: 17 -3.75,-4.881; 18 -3.25,-4.881; 19 -2.75,-4.881; 20 -2.25,-4.881; 21 -1.75,-4.881; 22 -1.25,-4.881; 23 -0.75,-4.881; 24 -0.25,-4.881; 25 0.25,-4.881; 26 0.75,-4.881; 27 1.25,-4.881; 28 1.75,-4.881; 29 2.25,-4.881; 30 2.75,-4.881; 31 3.25,-4.881; 32 3.75,-4.881; 49 3.75,4.881; 50 3.25,4.881; 51 2.75,4.881; 52 2.25,4.881; 53 1.75,4.881; 54 1.25,4.881; 55 0.75,4.881; 56 0.25,4.881; 57 -0.25,4.881; 58 -0.75,4.881; 59 -1.25,4.881; 60 -1.75,4.881; 61 -2.25,4.881; 62 -2.75,4.881; 63 -3.25,4.881; 64 -3.75,4.881
LSM9DS1TR = smd 0.23 x 1.35: C1 -1.075,1.725; CAP 0.215,1.725; CS_A/G -1.075,-1.725; CS_M -0.645,-1.725; DEN_A/G 1.505,-1.725; DRDY_M -0.215,-1.725; GND 1.075,1.725; GND_20 0.645,1.725; INT1_A/G 0.645,-1.725; INT2_A/G 1.075,-1.725; INT_M 0.215,-1.725; RES_18 1.505,1.725; SDO_M -1.505,-1.725; VDD -0.215,1.725; VDD_23 -0.645,1.725; VDDIO -1.505,1.725 | smd 1.35 x 0.23: RES 1.975,-0.645; RES_15 1.975,-0.215; RES_16 1.975,0.215; RES_17 1.975,0.645; SCL/SPC -1.975,0.645; SDA/SDI/SDO -1.975,-0.215; SDO_A/G -1.975,-0.645; VDDIO_3 -1.975,0.215
VIA-0.254MM = drill 0.254: P1 0,0
VIA_0.454 = drill 0.454: VIA 0,0
CRYSTAL-SMD-5X3 = smd 1.9 x 1.1: 1 -1.85,-1.15; 2 1.85,-1.15; 3 1.85,1.15; 4 -1.85,1.15

### Placement (x,y rotation side)
A  93.23,69.73 0 top
B1  87.58,68.93 180 top
BATT1  60.48,70.48 0 top
C1  87.58,72.23 270 top
C2  89.93,73.23 90 top
C3  77.53,56.68 270 top
C4  79.93,56.68 270 top
C5  80.88,77.68 90 top
C6  83.98,61.18 270 top
C7  78.78,77.68 90 top
C8  76.68,77.68 90 top
C9  76.48,82.38 0 top
C10  68.98,64.38 270 top
C11  71.08,64.38 270 top
C12  66.88,64.38 270 top
C13  71.08,73.58 90 top
C14  68.98,73.58 90 top
C15  60.88,74.08 0 top
C16  64.48,77.55 90 top
C17  35.98,101.98 135 top
C18  101.98,101.98 45 top
C19  35.98,35.98 225 top
C20  101.98,35.98 315 top
C21  50.68,85.68 135 top
C22  85.68,87.28 45 top
C23  52.28,50.68 225 top
C24  87.28,52.28 315 top
D1  44.48,93.48 45 top
D2  93.48,93.48 315 top
D3  44.48,44.48 135 top
D4  93.48,44.48 225 top
D5  66.58,53.78 0 top
D6  71.48,53.77 180 top
D7  52.39,66.98 270 top
J1  69.05,89.58 180 top
J2  55.08,69.88 90 top
J3  80.68,46.18 180 top
JP1  75.56,95.08 180 top
LOGO1  [LOGO_SCALE_0.9_L21]  55.65,79.95 0 top
LOGO2  [LOGO_SCALE_2.0_L22]  53.98,80.98 90 top
M1  41.78,95.48 45 top
M2  95.48,96.18 315 top
M3  42.48,41.78 135 top
M4  96.18,42.48 225 top
N1  60.48,64.88 315 top
Q1  47.98,89.98 45 top
Q2  89.98,89.98 315 top
Q3  47.98,47.98 135 top
Q4  89.98,47.98 225 top
R1  82.96,77.73 270 top
R2  62.88,58.78 270 top
R3  60.78,58.78 270 top
R4  53.98,83.98 135 top
R5  52.28,87.28 315 top
R6  83.98,83.98 45 top
R7  87.28,85.68 225 top
R8  53.98,53.98 225 top
R9  50.68,52.28 45 top
R10  83.98,53.98 315 top
R11  85.68,50.68 135 top
R12  66.58,56.58 90 top
R13  71.48,56.58 90 top
R14  52.38,71.48 90 top
REG  60.88,77.18 270 top
STAR1  [STAR_SCALE_0.1_L21]  111.38,26.98 180 top
STAR2  [STAR_SCALE_0.2_L21]  110.98,29.48 270 top
STAR3  [STAR_SCALE_0.3_L21]  111.08,26.98 90 top
STAR4  [STAR_SCALE_0.1_L21]  110.98,111.38 270 top
STAR5  [STAR_SCALE_0.2_L21]  108.48,110.98 0 top
STAR6  [STAR_SCALE_0.3_L21]  110.98,111.08 180 top
STAR7  [STAR_SCALE_0.1_L21]  26.58,110.98 0 top
STAR8  [STAR_SCALE_0.2_L21]  26.98,108.48 90 top
STAR9  [STAR_SCALE_0.3_L21]  26.88,110.98 270 top
STAR10  [STAR_SCALE_0.1_L21]  26.98,26.58 90 top
STAR11  [STAR_SCALE_0.2_L21]  29.48,26.98 180 top
STAR12  [STAR_SCALE_0.3_L21]  26.98,26.88 0 top
STAR13  [STAR_SCALE_0.1_L21]  88.48,58.58 90 top
STAR14  [STAR_SCALE_0.1_L21]  57.98,64.08 180 top
STAR15  [STAR_SCALE_0.1_L21]  45.18,59.58 270 top
STAR16  [STAR_SCALE_0.1_L21]  61.68,53.18 270 top
STAR17  [STAR_SCALE_0.1_L21]  43.98,79.88 0 top
STAR18  [STAR_SCALE_0.1_L21]  63.58,86.28 180 top
STAR19  [STAR_SCALE_0.1_L21]  79.88,93.78 270 top
STAR20  [STAR_SCALE_0.1_L21]  92.38,80.18 180 top
STAR21  [STAR_SCALE_0.2_L21]  55.78,59.98 270 top
STAR22  [STAR_SCALE_0.2_L21]  53.78,78.18 90 top
STAR23  [STAR_SCALE_0.2_L21]  78.33,84.23 0 top
STAR24  [STAR_SCALE_0.2_L21]  56.18,94.08 180 top
STAR25  [STAR_SCALE_0.2_L21]  93.08,58.48 270 top
STAR26  [STAR_SCALE_0.2_L21]  71.28,50.28 270 top
STAR27  [STAR_SCALE_0.2_L21]  54.18,44.68 90 top
SW  46.23,68.98 180 top
U1  79.68,69.48 180 top
U2  68.98,68.98 0 top
V1  76.58,67.72 0 top
V2  77.68,71.48 0 top
V3  62.18,77.23 0 top
V4  81.68,71.48 0 top
V5  31.98,105.98 0 top
V6  105.98,105.98 0 top
V7  31.98,31.98 0 top
V8  105.98,31.98 0 top
V9  39.98,97.98 0 top
V10  97.98,97.98 0 top
V11  39.98,39.98 0 top
V12  97.98,39.98 0 top
V13  86.98,66.48 0 top
V14  87.98,66.48 0 top
V15  88.98,66.48 0 top
V16  89.98,66.48 0 top
V17  89.98,65.28 0 top
V18  86.98,63.98 0 top
V19  87.98,63.98 0 top
V20  88.98,63.98 0 top
V21  86.98,76.08 0 top
V22  87.98,76.08 0 top
V23  88.98,76.08 0 top
V24  89.98,76.08 0 top
V25  86.98,65.28 0 top
V26  87.98,65.28 0 top
V27  88.98,65.28 0 top
V28  54.98,87.95 0 top
V29  87.95,82.98 0 top
V30  54.98,50 0 top
V31  87.95,54.98 0 top
V32  65.74,69.19 0 top
V33  61,62.98 0 top
V34  89.98,63.98 0 top
V35  77.68,67.48 0 top
V36  81.68,67.48 0 top
V37  78.43,63.45 0 top
V38  50.32,90.42 0 top
V39  90.42,87.63 0 top
V40  47.53,50.32 0 top
V41  87.63,47.53 0 top
V42  86.98,74.88 0 top
V43  87.98,74.88 0 top
Y1  79.38,60.69 0 top

### Tracks (layer width: path | path; a pad name or v marks a point on that pad's centre or on a via)
3V  (via drill 0.2)
  Top 0.127: 80.41,75.14 80.41,74.37 U1.23 80.41,75.14 | 67.01,67.9 67.01,67.71 67.45,67.26 U2.SDO_M 67.52,67.26 67.9,67.26 U2.CS_A/G 67.96,67.26 68.28,67.26 U2.CS_M 68.34,67.2 68.34,65.29 | 67.01,67.9 67.01,68.28 U2.SDO_A/G | 68.98,65.29 68.34,65.29 | 68.34,65.29 66.88,65.29 C12.1 | 70.53,65.83 71.07,65.29 C11.1 | 70.53,65.83 70.5,65.86 70.5,67.2 U2.DEN_A/G | 68.98,65.29 69.99,65.29 70.53,65.83 | 68.98,65.29 C10.1 68.34,65.29 | 61.8,57.86 62.82,57.86 R2.2 | 61.8,57.86 60.78,57.86 R3.2 | U2.VDD_23 68.34,70.69 68.72,70.69 U2.VDD 68.78,70.75 68.78,71.39 69.29,71.9 69.61,71.9 69.93,72.21 69.93,73.1 69.61,73.42 68.34,73.42 67.52,72.59 67.52,70.75 U2.VDDIO 67.45,70.69 66.88,70.69 66.12,69.93 66.12,69.23 | REG.5 V3.P1 62.24,77.23 62.37,77.23 62.94,76.66 C16.1 | 66.12,69.23 66.94,69.23 U2.VDDIO_3 | 66.12,69.23 65.74,69.23 V32.P1 65.67,69.17 65.48,68.98 65.48,68.15 65.74,67.9 67.01,67.9 | v61.8,58.37 61.8,57.86 | 81.52,77.52 81.48,77.55 79.58,77.55 78.82,76.79 C7.1 | 81.52,77.52 82.25,76.79 82.95,76.79 R1.2 | C8.1 76.72,76.79 78.75,76.79 C7.1 | 80.41,75.14 78.82,76.72 C7.1 | v81.55,77.68 81.55,77.55 81.52,77.52 | U1.54 V37.P1
  Top 0.152: U1.54 78.43,65.32 78.96,65.86 80.39,65.86 80.93,65.33 U1.59 | V1.P1 75.78,67.72 | 75.78,67.72 U1.44 | U1.34 75.5,72.73 75.78,72.45 75.78,67.72
  pour Route15 (isolate 0.05): 63.98,71.78 71.98,71.78 71.98,66.18 65.98,66.18 65.98,71.18 63.98,71.18 63.98,67.08 48.88,51.98 51.88,48.98 63.78,48.98 63.88,44.78 81.98,44.78 89.98,52.78 89.98,61.88 85.08,61.88 85.08,77.48 89.98,77.48 89.98,85.08 86.08,88.98 51.88,88.98 48.58,85.68 59.78,74.48 63.98,74.48
BAT_GND
  Top 0.762: C15.2 61.8,74.06 61.8,69.86 BATT1.- | D7.C 52.4,65.74 57.67,65.74 61.48,69.55 BATT1.- | V7.P1 C19.2 | V8.P1 C20.2 | V5.P1 C17.2 | V6.P1 C18.2 | V41.P1 88.33,48.23 Q4.S | V40.P1 48.23,49.62 Q3.S | V38.P1 49.62,89.72 Q1.S | V39.P1 89.72,88.33 Q2.S | N1.1 61.75,67.21 BATT1.-
  pour Route2 (isolate 0.05): 62.88,47.98 62.88,43.88 81.98,43.88 90.28,52.18 112.38,30.08 107.88,25.58 89.08,44.38 81.98,41.98 68.98,40.38 55.98,41.98 48.88,44.38 30.08,25.58 25.58,30.08 44.38,48.88 41.98,55.98 40.38,68.98 41.98,81.98 44.38,89.08 25.58,107.88 30.08,112.38 48.88,93.58 55.98,95.98 68.98,97.58 81.98,95.98 89.08,93.58 107.88,112.38 112.38,107.88 90.28,85.78 86.08,89.98 51.88,89.98 47.58,85.68 59.78,73.48 63.08,73.48 63.08,67.18 47.88,51.98 51.88,47.98
BATT1
  Top 0.762: BATT1.+ 55.11,69.84 J2.1
C1
  Top 0.28: B1.2 C1.2
C2
  Top 0.762: B1.1 A.FEED C2.1
C3
  Top 0.127: C3.1 Y1.1 77.55,59.58 79.39,61.42 79.39,64.59 U1.56
C4
  Top 0.127: U1.57 79.93,61.84 | 79.93,61.84 C4.1 | Y1.3 79.93,61.84
C5
  Top 0.127: C5.1 80.91,76.72 80.91,74.37 U1.22 80.98,74.37 81.42,74.37 U1.21
C6
  Top 0.127: C6.1 83.96,62.12 83.2,62.12 81.48,63.83 81.48,64.59 U1.60
C9
  Top 0.127: C9.1 75.58,82.44 75.58,95.07 JP1.DTR
C13
  Top 0.127: U2.CAP 69.23,70.75 69.23,71.39 69.48,71.64 70.05,71.64 71.07,72.66 C13.1
C14
  Top 0.127: U2.C1 67.96,70.75 67.96,71.64 68.98,72.66 C14.1
C21
  Top 0.127: 52.97,85.04 52.97,84.98 R4.2 | 52.97,85.04 52.97,86.57 R5.2 | 52.97,85.04 51.32,85.04 C21.1 51.26,85.1 51.26,86.37 49.35,88.28 48.34,88.28 Q1.G
C22
  Top 0.127: 85.1,84.66 86.25,84.66 86.57,84.98 R7.2 | 85.1,84.66 R6.2 85.1,84.66 | 85.1,84.66 85.1,86.63 C22.1 85.17,86.63 86.31,86.63 88.28,88.6 88.28,89.61 Q2.G
C23
  Top 0.127: 52.91,52.97 52.97,52.97 R8.2 | 52.91,52.97 51.39,52.97 R9.2 | 52.91,52.97 52.91,51.32 C23.1 52.85,51.26 51.58,51.26 49.67,49.35 49.67,48.34 Q3.G
C24
  Top 0.127: 84.98,52.91 84.98,52.97 R10.2 | 84.98,52.91 84.98,51.39 R11.2 | 84.98,52.91 86.63,52.91 C24.1 86.69,52.85 86.69,51.58 88.6,49.67 89.61,49.67 Q4.G
D5
  Top 0.127: R12.1 66.56,55.58 66.56,55.01 65.36,53.8 D5.A
D6
  Top 0.127: R13.1 71.52,55.58 71.52,55.01 72.72,53.8 D6.A
D7
  Top 0.127: R14.1 52.4,70.5 52.4,68.28 D7.A
GND
  Top 0.127: D5.C 67.83,53.8 70.18,53.8 D6.C 70.25,53.74 71.07,53.74 71.9,52.91 74.63,52.91 77.48,55.77 C3.2 C4.2 79.96,55.83 79.96,56.21 84.03,60.28 C6.2 | REG.2 59.58,77.23 60.09,77.23 61.48,78.63 64.34,78.63 64.47,78.5 C16.2 64.53,78.44 65.04,78.44 68.98,74.5 | 68.98,74.5 71.07,74.5 C13.2 71.13,74.44 71.13,74.06 72.02,73.17 72.02,72.15 70.56,70.69 U2.RES_18 | U2.GND_20 69.67,70.69 69.99,70.69 U2.GND 70.05,70.69 70.44,70.69 U2.RES_18 | U2.RES_18 70.5,70.69 70.94,70.25 70.94,69.67 U2.RES_17 70.94,69.61 70.94,69.23 U2.RES_16 70.94,69.17 70.94,68.78 U2.RES_15 70.94,68.72 70.94,68.34 U2.RES 71.01,68.28 71.01,66.75 72.02,65.74 72.02,64.53 71.07,63.58 C11.2 71.07,63.51 68.98,63.51 | 68.98,74.5 C14.2 | SW.3 44.02,64.47 44.02,73.48 SW.4 44.02,73.55 44.02,76.47 51.29,83.74 | C5.2 80.85,78.63 78.82,78.63 C7.2 78.75,78.63 76.72,78.63 C8.2 76.66,78.56 76.66,78.18 75.58,77.1 75.58,73.17 | 68.98,63.51 66.88,63.51 C12.2 66.82,63.51 61.04,63.51 | 68.98,63.51 C10.2 | U1.35 74.75,72.28 73.99,72.28 73.8,72.47 73.8,72.98 73.99,73.17 74.75,73.17 U1.33 74.82,73.17 75.58,73.17 | R11.1 86.31,49.99 84.53,49.99 80.72,46.18 J3.1 | R9.1 50.05,51.64 50.05,52.91 51.39,54.24 53.29,54.24 54.94,52.59 54.94,50.05 V30.P1 54.88,50.05 51.7,50.05 C23.2 | 54.24,87.96 54.94,87.96 V28.P1 | 54.24,87.96 51.64,87.96 R5.1 | 87.96,83.71 87.96,83.01 V29.P1 | 87.96,83.71 87.96,86.31 R7.1 | C24.2 87.96,51.7 87.96,54.94 V31.P1 | 51.29,83.74 51.32,83.71 53.29,83.71 54.24,84.66 54.24,87.96 | 51.29,83.74 50.05,84.98 50.05,86.25 C21.2 | 87.96,83.71 84.66,83.71 83.71,84.66 83.71,86.63 84.98,87.9 86.25,87.9 C22.2
  Top 0.127: U1.45 74.82,67.26 77.48,67.26 77.68,67.45 V35.VIA | 83.58,68.72 83.45,68.72 81.99,67.26 81.93,67.23 | 83.58,68.72 84.53,68.72 U1.7 | 80.75,72.44 81.68,71.52 V4.VIA | 80.75,72.44 79.96,73.23 79.96,74.31 U1.24 | 80.75,72.44 81.87,73.55 81.87,74.31 U1.20 | 83.58,68.72 83.58,69.99 83.77,70.18 84.53,70.18 U1.10 84.6,70.25 84.6,70.69 U1.11 | 75.58,73.17 76.02,73.17 77.68,71.52 V2.VIA | 61.04,63.51 61.04,63.01 V33.P1 | 61.04,63.51 61.04,64.34 N1.2 | JP1.GND 62.88,95.07 62.88,91.96 66.5,88.34 J1.6 | U1.58 80.43,63.88 80.73,63.58 81.3,63.58 82.78,62.1 82.78,61.48 C6.2 | C6.2 86.98,63.28 V18.P1
  Top 0.152: U1.58 80.43,65.43 80.27,65.58 79.08,65.58 78.93,65.43 U1.55 | V36.VIA 81.93,67.23 U1.61
  pour Top (isolate 0.01): 85.78,62.53 89.98,62.53 89.98,76.83 85.78,76.83
  pour Route2 (isolate 0.05): 63.98,71.78 71.98,71.78 71.98,66.18 65.98,66.18 65.98,71.18 63.98,71.18 63.98,67.08 48.88,51.98 51.88,48.98 63.78,48.98 63.88,44.78 81.98,44.78 89.98,52.78 89.98,85.08 86.08,88.98 51.88,88.98 48.58,85.68 59.78,74.48 63.98,74.48
  pour Route15: 89.98,76.83 85.78,76.83 85.78,62.53 89.98,62.53
M1
  Top 0.762: M1.V- 43.21,96.84 45.37,94.68 45.62,94.68 D1.A 45.81,94.3 46.77,93.34 46.77,91.18 Q1.D
M2
  Top 0.762: M2.V- 96.84,94.74 94.68,92.58 94.68,92.33 D2.A 94.3,92.14 93.34,91.18 91.18,91.18 Q2.D
M3
  Top 0.762: M3.V- 41.11,43.21 43.27,45.37 43.27,45.62 D3.A 43.65,45.81 44.61,46.77 46.77,46.77 Q3.D
M4
  Top 0.762: M4.V- 94.74,41.11 92.58,43.27 92.33,43.27 D4.A 92.14,43.65 91.18,44.61 91.18,46.77 Q4.D
MISO
  Top 0.127: U1.39 74.75,70.25 73.48,70.25 72.28,71.45 72.28,83.45 67.9,87.84 67.9,91.33 68.59,92.03 70.44,92.03 71.58,90.88 J1.1
MOSI  (via drill 0.2)
  Top 0.127: v73.61,70.75 74.75,70.75 U1.38
  Bottom 0.127: v73.61,70.75 76.15,70.75 78.12,72.72 79.14,72.72 79.39,72.98 79.39,77.99 69.1,88.28 J1.4
PB6
  Top 0.127: R12.2 66.63,57.55 70.18,57.55 73.61,60.97 73.67,60.97 73.93,61.23 73.93,64.98 73.55,65.36 73.55,68.21 74.06,68.72 74.75,68.72 U1.42
PB7
  Top 0.127: R13.2 71.52,57.55 71.52,58.43 74.18,61.1 74.18,65.1 73.8,65.48 73.8,67.96 74.06,68.21 74.75,68.21 U1.43
PWM1  (via drill 0.2)
  Top 0.127: R4.1 54.62,83.26 54.62,81.74 47.58,74.69 47.58,60.78 62.18,46.18 62.88,46.18 J3.8 | v75.39,64.09 75.9,64.59 U1.49
  Bottom 0.127: v75.39,64.09 75.14,64.09 71.58,60.53 71.58,45.8 70.63,44.85 64.21,44.85 62.94,46.12 J3.8
PWM2  (via drill 0.2)
  Top 0.127: v83.26,82.18 83.26,83.26 R6.1 | v80.28,69.36 80.28,69.17 76.47,65.36 76.47,64.66 U1.50
  Bottom 0.127: v83.26,82.18 83.26,77.1 80.28,74.12 v80.28,69.36 80.28,68.34 75.58,63.64 75.07,63.64 73.04,61.61 73.04,46.18 J3.4
PWM3
  Top 0.127: 62.4,49.2 65.42,46.18 J3.7 | 62.4,49.2 56.97,54.62 54.69,54.62 R8.1 | 62.4,49.2 66.31,53.1 66.31,53.93 68.66,56.28 71.52,56.28 72.4,57.16 72.4,58.69 76.91,63.2 76.91,64.59 U1.51
PWM4  (via drill 0.2)
  Top 0.127: R10.1 83.26,54.62 83.26,53.8 75.64,46.18 J3.3 | v73.48,61.42 73.29,61.61 73.29,68.47 73.99,69.17 74.75,69.17 U1.41
  Bottom 0.127: v73.48,61.42 73.48,48.27 75.58,46.18 J3.3
RESET
  Top 0.127: SW.1 48.53,64.47 48.53,73.48 SW.2 48.59,73.48 53.29,73.48 67.64,87.84 67.64,90.37 67.13,90.88 J1.5 66.56,90.88 67.07,90.88 68.47,92.28 72.34,92.28 74.82,89.8 74.82,81.74 75.14,81.42 76.4,81.42 C9.2 77.42,82.37 78.5,82.37 82.18,78.69 R1.1 83.01,78.63 85.55,76.09 85.55,71.5 85.28,71.23 U1.12
RFN
  Top 0.152: U1.9 B1.3
RFP
  Top 0.152: U1.8 85.83,69.23 B1.4
RXD0  (via drill 0.2)
  Top 0.127: v76.28,66.75 74.82,66.75 U1.46
  Bottom 0.127: v76.28,66.75 77.1,67.58 77.1,70.12 79.64,72.66 79.64,85.93 70.5,95.07 JP1.TXO
SCK
  Top 0.127: U1.37 74.75,71.26 74.06,71.26 72.53,72.79 72.53,85.74 70.18,88.09 70.18,89.74 69.1,90.82 J1.3
SCL  (via drill 0.2)
  Top 0.127: v66.94,70.12 66.94,69.67 U2.SCL/SPC | v61.86,60.28 61.36,59.77 60.78,59.77 R3.1 | v78.95,73.17 79.39,73.61 79.39,74.31 U1.25
  Bottom 0.127: 66.94,60.28 66.94,47.2 67.96,46.18 J3.6 | 66.94,60.28 v66.94,70.12 69.99,73.17 v78.95,73.17 | 66.94,60.28 v61.86,60.28
SDA  (via drill 0.2)
  Top 0.127: v65.93,68.34 66.31,68.72 66.94,68.72 U2.SDA/SDI/SDO | v65.93,62.82 62.88,59.77 R2.1 | v78.5,75.52 78.88,75.14 78.88,74.37 U1.26
  Bottom 0.127: v78.5,75.52 71.71,75.52 66.18,69.99 66.18,68.59 v65.93,68.34 v65.93,62.82 63.77,62.82 61.42,60.47 61.42,60.09 66.5,55.01 66.5,46.18 67.58,45.1 68.34,45.1 69.36,46.12 70.5,46.12 J3.5
TXD0  (via drill 0.2)
  Top 0.127: v75.96,66.24 74.82,66.24 U1.47
  Bottom 0.127: v75.96,66.24 77.23,66.24 79.83,68.85 79.83,72.47 79.9,72.53 79.9,88.22 73.04,95.07 JP1.RXI
VBAT
  Top 0.762: D4.C 94.68,45.62 94.68,45.37 96.84,43.21 M4.V+ 97.03,42.83 97.03,41.18 97.85,40.35 V12.P1 C20.1 | D2.C 92.33,94.68 92.58,94.68 94.74,96.84 M2.V+ 95.12,97.03 96.77,97.03 97.6,97.85 V10.P1 C18.1 | D1.C 43.27,92.33 43.27,92.58 41.11,94.74 M1.V+ 40.92,95.12 40.92,96.77 40.1,97.6 V9.P1 C17.1 | D3.C 45.62,43.27 45.37,43.27 43.21,41.11 M3.V+ 42.83,40.92 41.18,40.92 40.35,40.1 V11.P1 C19.1 | 59.58,74.5 REG.3 59.2,76.34 58.82,76.34 58.43,76.72 58.43,77.68 58.88,78.12 59.51,78.12 REG.1 | 59.58,74.5 59.96,74.12 C15.1 | R14.2 52.4,72.47 55.07,72.47 J2.2 55.39,72.66 57.04,74.31 59.26,74.31 59.58,74.5
  pour Route15 (isolate 0.05): 62.88,47.98 62.88,43.88 81.98,43.88 90.28,52.18 112.38,30.08 107.88,25.58 89.08,44.38 81.98,41.98 68.98,40.38 55.98,41.98 48.88,44.38 30.08,25.58 25.58,30.08 44.38,48.88 41.98,55.98 40.38,68.98 41.98,81.98 44.38,89.08 25.58,107.88 30.08,112.38 48.88,93.58 55.98,95.98 68.98,97.58 81.98,95.98 89.08,93.58 107.88,112.38 112.38,107.88 90.28,85.78 86.08,89.98 51.88,89.98 47.58,85.68 59.78,73.48 63.08,73.48 63.08,67.18 47.88,51.98 51.78,47.98

### Text on the board
tPlace: BGND | P1 | SCL | P2 | 3V | VBAT | P3 | SDA | P4 | GND